# EAGLE design pcb_telemetria (EAGLE 9.5.1)
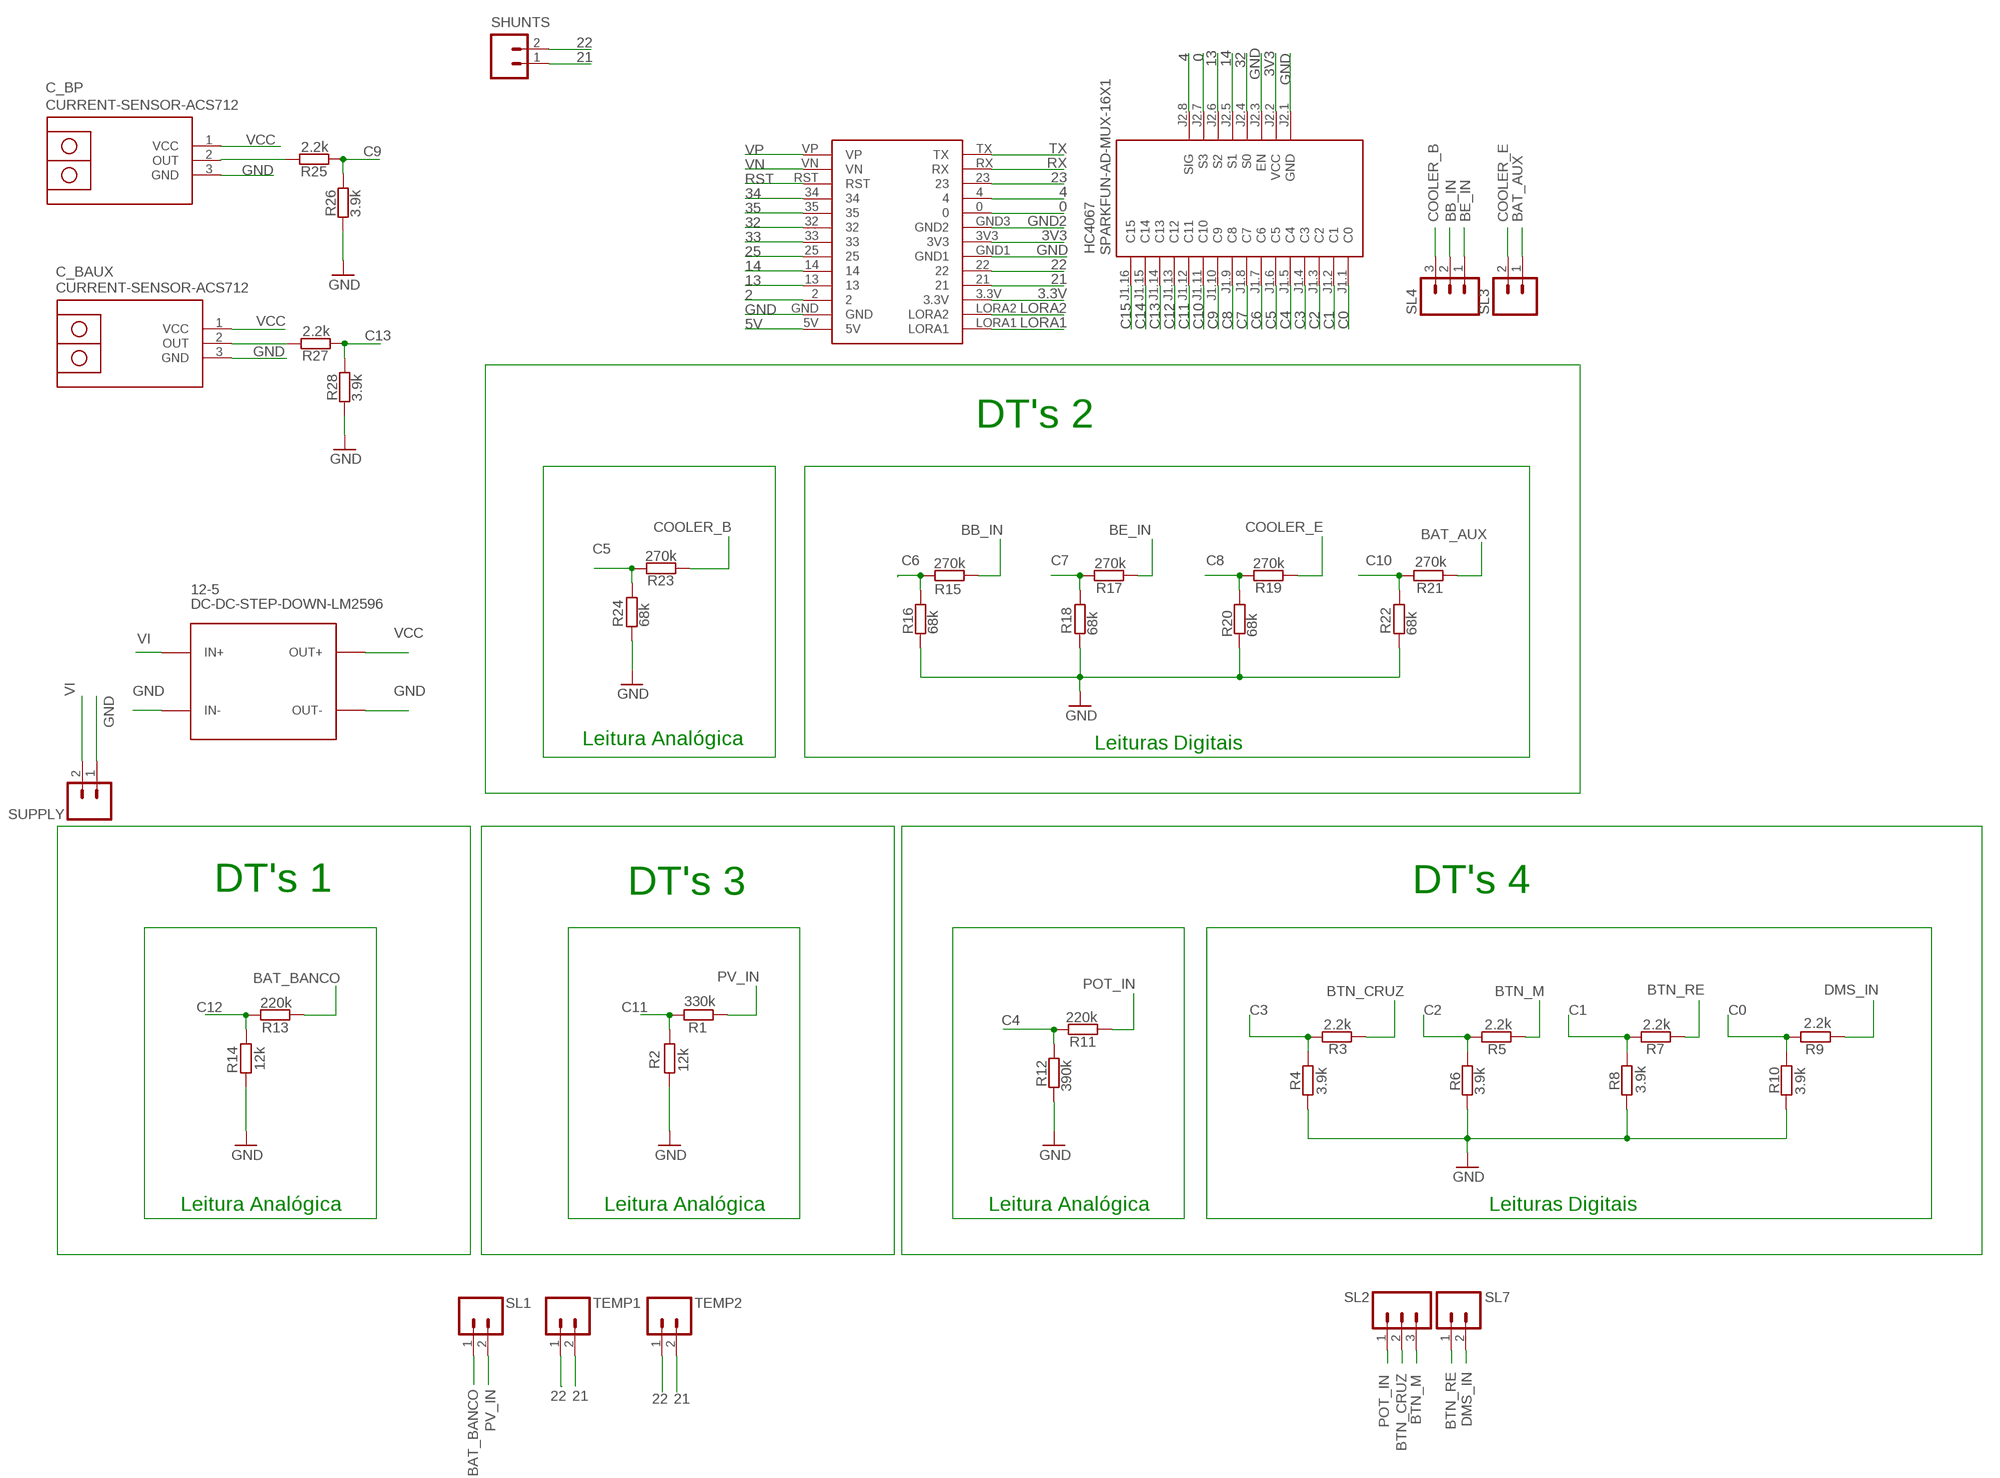
[diagram p0: schematic, sheet 1]

## Parts
12-5  DC-DC-STEP-DOWN-LM2596  [DC-DC-STEP-DOWN-LM2596]
C_BAUX  CURRENT-SENSOR-ACS712  [CURRENT-SENSOR-ACS712]
C_BP  CURRENT-SENSOR-ACS712  [CURRENT-SENSOR-ACS712]
HC4067  SPARKFUN-AD-MUX-16X1  [SPARKFUN-AD-MUX-16X1]
R1  330k  R-EU_0204/7  [0204/7]
R2  12k  R-EU_0204/7  [0204/7]
R3  2.2k  R-EU_0204/7  [0204/7]
R4  3.9k  R-EU_0204/7  [0204/7]
R5  2.2k  R-EU_0204/7  [0204/7]
R6  3.9k  R-EU_0204/7  [0204/7]
R7  2.2k  R-EU_0204/7  [0204/7]
R8  3.9k  R-EU_0204/7  [0204/7]
R9  2.2k  R-EU_0204/7  [0204/7]
R10  3.9k  R-EU_0204/7  [0204/7]
R11  220k  R-EU_0204/7  [0204/7]
R12  390k  R-EU_0204/7  [0204/7]
R13  220k  R-EU_0204/7  [0204/7]
R14  12k  R-EU_0204/7  [0204/7]
R15  270k  R-EU_0204/7  [0204/7]
R16  68k  R-EU_0204/7  [0204/7]
R17  270k  R-EU_0204/7  [0204/7]
R18  68k  R-EU_0204/7  [0204/7]
R19  270k  R-EU_0204/7  [0204/7]
R20  68k  R-EU_0204/7  [0204/7]
R21  270k  R-EU_0204/7  [0204/7]
R22  68k  R-EU_0204/7  [0204/7]
R23  270k  R-EU_0204/7  [0204/7]
R24  68k  R-EU_0204/7  [0204/7]
R25  2.2k  R-EU_0204/7  [0204/7]
R26  3.9k  R-EU_0204/7  [0204/7]
R27  2.2k  R-EU_0204/7  [0204/7]
R28  3.9k  R-EU_0204/7  [0204/7]
SHUNTS  M02  [02P]
SL1  M02  [02P]
SL2  M03  [03P]
SL3  M02  [02P]
SL4  M03  [03P]
SL7  M02  [02P]
SUPPLY  M02  [02P]
TEMP1  M02  [02P]
TEMP2  M02  [02P]
U$1  TTGOBEAM  [TTGOBEAM]

## Nets
0: HC4067.J2.7(S3) U$1.0
2: U$1.2
3.3V: U$1.3.3V
3V3: HC4067.J2.2(VCC) U$1.3V3
4: HC4067.J2.8(SIG) U$1.4
5V: U$1.5V
13: HC4067.J2.6(S2) U$1.13
14: HC4067.J2.5(S1) U$1.14
21: SHUNTS.1 TEMP1.2 TEMP2.2 U$1.21
22: SHUNTS.2 TEMP1.1 TEMP2.1 U$1.22
23: U$1.23
25: U$1.25
32: HC4067.J2.4(S0) U$1.32
33: U$1.33
34: U$1.34
35: U$1.35
BAT_AUX: R21.2 SL3.1
BAT_BANCO: R13.2 SL1.1
BB_IN: R15.1 SL4.2
BE_IN: R17.2 SL4.1
BTN_CRUZ: R3.1 SL2.2
BTN_M: R5.2 SL2.3
BTN_RE: R7.1 SL7.1
C0: HC4067.J1.1(C0) R9.1 R10.2
C1: HC4067.J1.2(C1) R7.2 R8.1
C2: HC4067.J1.3(C2) R5.1 R6.2
C3: HC4067.J1.4(C3) R3.2 R4.1
C4: HC4067.J1.5(C4) R11.2 R12.1
C5: HC4067.J1.6(C5) R23.2 R24.1
C6: HC4067.J1.7(C6) R15.2 R16.1
C7: HC4067.J1.8(C7) R17.1 R18.2
C8: HC4067.J1.9(C8) R19.2 R20.1
C9: HC4067.J1.10(C9) R25.1 R26.1
C10: HC4067.J1.11(C10) R21.1 R22.2
C11: HC4067.J1.12(C11) R1.1 R2.2
C12: HC4067.J1.13(C12) R13.1 R14.2
C13: HC4067.J1.14(C13) R27.1 R28.1
C14: HC4067.J1.15(C14)
C15: HC4067.J1.16(C15)
COOLER_B: R23.1 SL4.3
COOLER_E: R19.1 SL3.2
DMS_IN: R9.2 SL7.2
GND: 12-5.IN- 12-5.OUT- C_BAUX.3(GND) C_BP.3(GND) HC4067.J2.1(GND) HC4067.J2.3(EN) R2.1 R4.2 R6.1 R8.2 R10.1 R12.2 R14.1 R16.2 R18.1 R20.2 R22.1 R24.2 R26.2 R28.2 SUPPLY.1 U$1.GND U$1.GND1
GND2: U$1.GND3(GND2)
LORA1: U$1.LORA1
LORA2: U$1.LORA2
N$1: C_BP.2(OUT) R25.2
N$2: C_BAUX.2(OUT) R27.2
POT_IN: R11.1 SL2.1
PV_IN: R1.2 SL1.2
RST: U$1.RST
RX: U$1.RX
TX: U$1.TX
VCC: 12-5.OUT+ C_BAUX.1(VCC) C_BP.1(VCC)
VI: 12-5.IN+ SUPPLY.2
VN: U$1.VN
VP: U$1.VP

## Notes on the sheet
- DT's 2
- Leitura Analógica | Leituras Digitais
- DT's 1 | DT's 3 | DT's 4
- Leitura Analógica | Leitura Analógica | Leitura Analógica | Leituras Digitais

## Library data of the parts
12-5 = diy-modules:DC-DC-STEP-DOWN-LM2596: DC/DC Step-Down Regulator based on LM2596-ADJ chip LM2596 datasheet available here: http://www.ti.com/lit/ds/symlink/lm2596.pdf Click here to find device on ebay.com <http://www.ebay.com/sch/lm2596+power+regulator>
C_BAUX C_BP = diy-modules:CURRENT-SENSOR-ACS712: Isolated Bipolar Current Sensors based on ACS712 chip More details available here: http://embedded-lab.com/blog/a-brief-overview-of-allegro-acs712-current-sensor-part-1/ Click here to find device on ebay.com <http://www.ebay.com/sch/acs712+module> Note: There are many available versions with different pinout. Please check before use
HC4067 = diy-modules:SPARKFUN-AD-MUX-16X1: SparkFun Analog/Digital MUX Breakout based on CD74HC4067 chip Source: https://www.sparkfun.com/products/9056
R1-R28 = rcl:R-EU_: RESISTOR, European symbol; SPICEPREFIX: R
SHUNTS SL1 SL3 SL7 SUPPLY TEMP1 TEMP2 = con-amp-quick:M02: AMP QUICK CONNECTOR; OC_FARNELL: unknown; OC_NEWARK: unknown
SL2 SL4 = con-amp-quick:M03: AMP QUICK CONNECTOR; OC_FARNELL: unknown; OC_NEWARK: unknown
U$1 = bibliotecattgo:TTGOBEAM

## Board
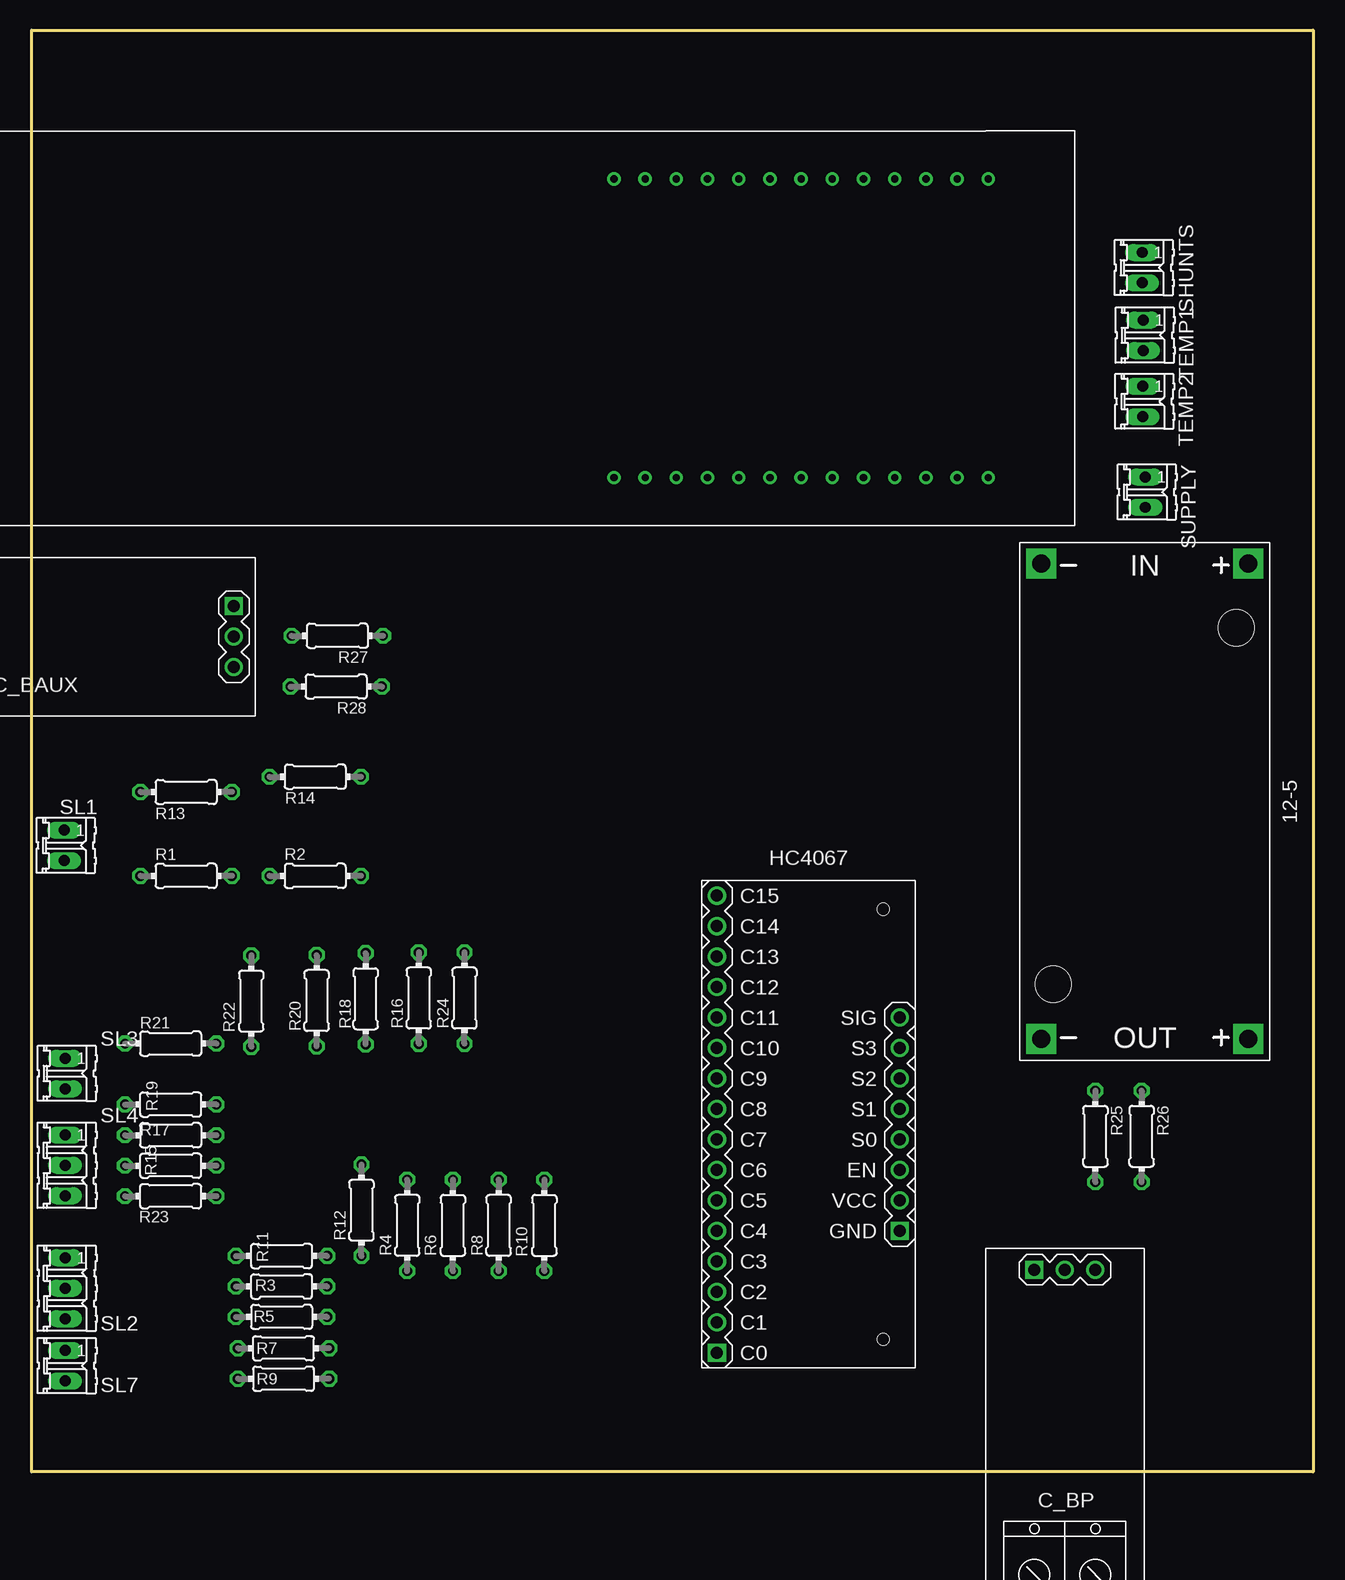
[diagram p1: board, top side]
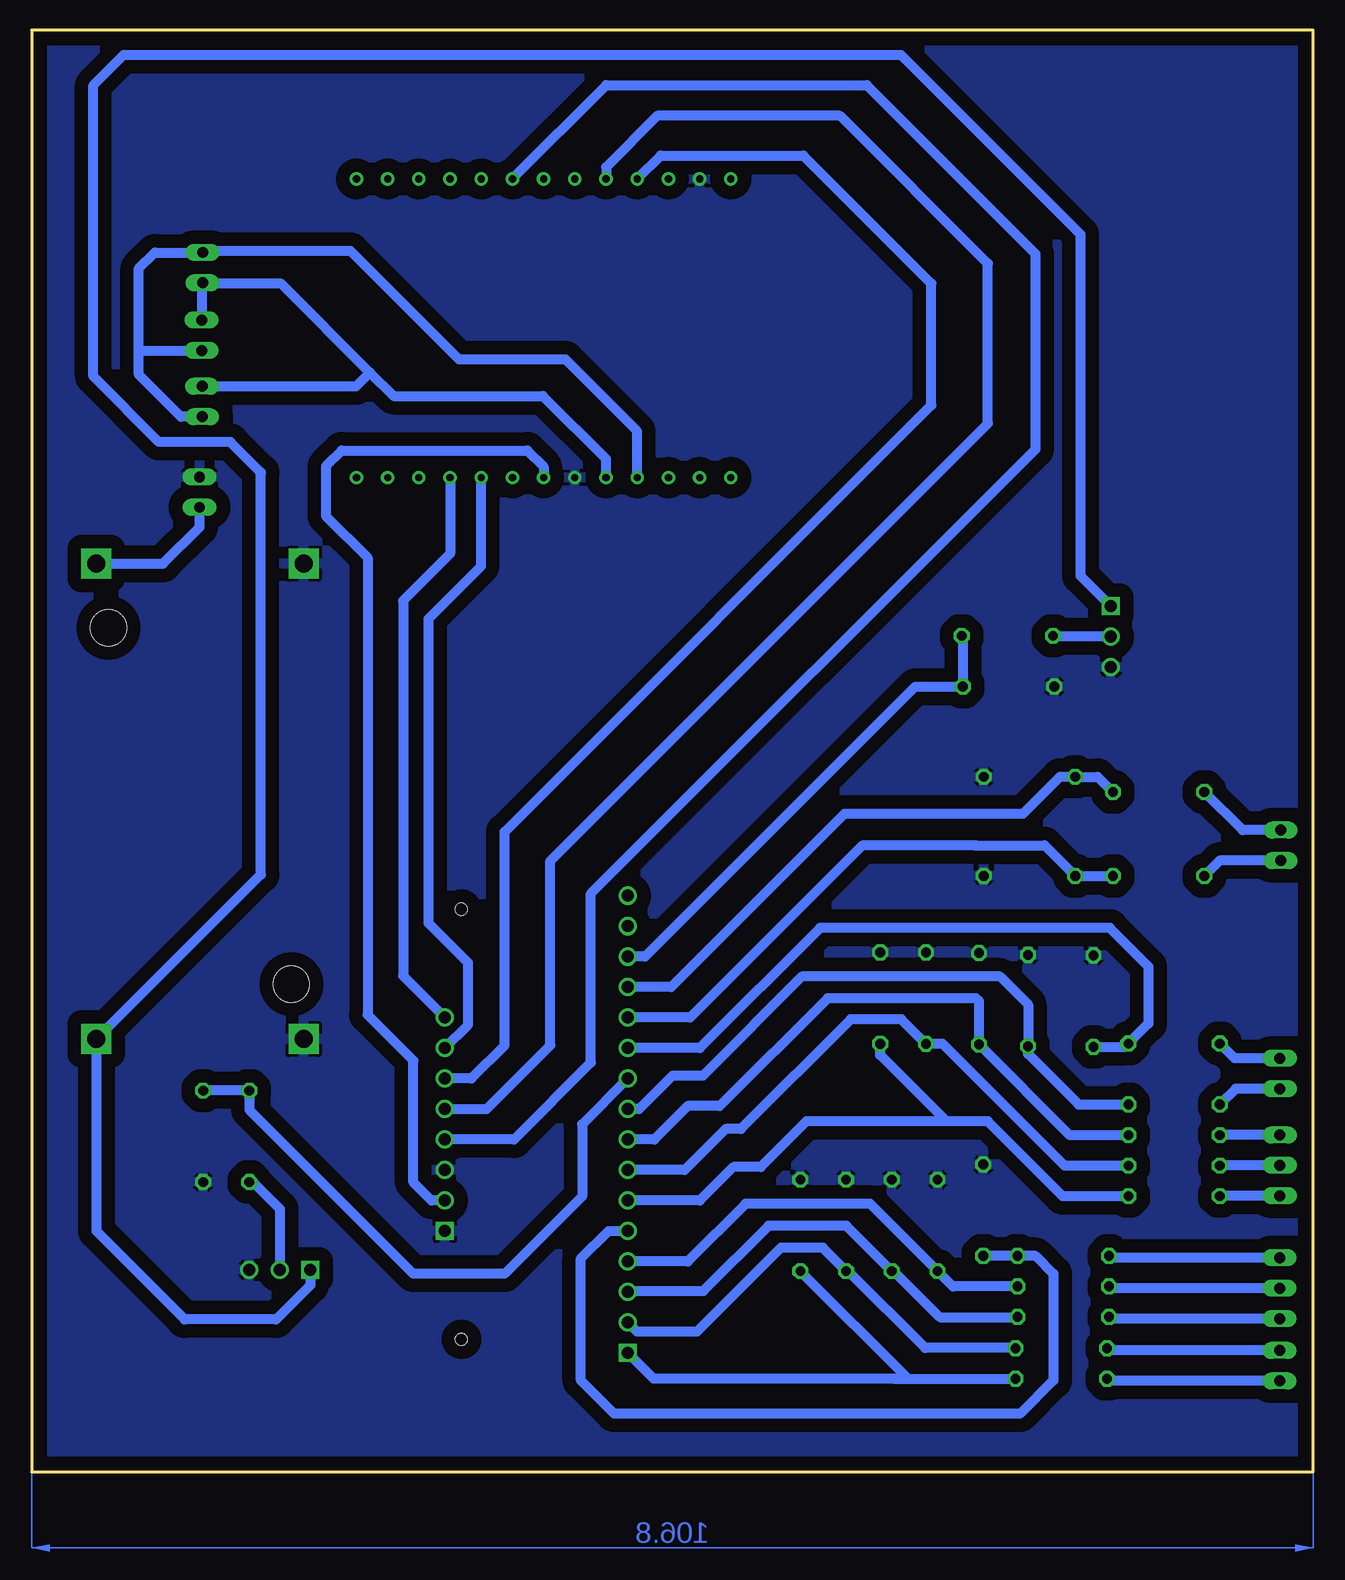
[diagram p2: board, bottom side, seen from below]

Size 106.8 x 120.19 mm. Coordinates in mm from the lower left corner, seen from the top.
Outline: 0,0 0,120.19 106.8,120.19 106.8,0 0,0
Copper layers (1*16): Top 0.035mm / dielectric 1.5mm / Bottom 0.035mm
Design rules "default *": minimum track width 32mil, minimum drill 0.35mm, track to track 24mil, track to pad 24mil, pad to pad 24mil, via to via 24mil, smd to smd 24mil, copper to edge 40mil, drill to drill 24mil, minimum pad ring 10mil, minimum via ring 8mil, stop-mask expansion 4mil, vias tented up to drill 0mil, thermal gap 10mil

### Footprints (pad centres in the part's own frame; a part is rotated, then mirrored left to right if it is on the bottom)
DC-DC-STEP-DOWN-LM2596 = drill 1.5 pad 2.5 square: IN+ -19.812,8.636; IN- -19.812,-8.636; OUT+ 19.812,8.636; OUT- 19.812,-8.636 | hole 3: -14.478,7.62; 15.24,-7.62
CURRENT-SENSOR-ACS712 = drill 1 square: 1 13.97,2.54 | drill 1: 2 13.97,0; 3 13.97,-2.54
SPARKFUN-AD-MUX-16X1 = drill 1 square: J1.1 -7.62,-19.05; J2.1 7.62,-8.89 | drill 1: J1.2 -7.62,-16.51; J1.3 -7.62,-13.97; J1.4 -7.62,-11.43; J1.5 -7.62,-8.89; J1.6 -7.62,-6.35; J1.7 -7.62,-3.81; J1.8 -7.62,-1.27; J1.9 -7.62,1.27; J1.10 -7.62,3.81; J1.11 -7.62,6.35; J1.12 -7.62,8.89; J1.13 -7.62,11.43; J1.14 -7.62,13.97; J1.15 -7.62,16.51; J1.16 -7.62,19.05; J2.2 7.62,-6.35; J2.3 7.62,-3.81; J2.4 7.62,-1.27; J2.5 7.62,1.27; J2.6 7.62,3.81; J2.7 7.62,6.35; J2.8 7.62,8.89 | hole 1: 6.245,-17.93; 6.245,17.93
0204/7 = drill 0.813 octagon: 1 -3.81,0; 2 3.81,0
02P = drill 0.914 long: 1 -1.27,0; 2 1.27,0
03P = drill 0.914 long: 1 -2.54,0; 2 0,0; 3 2.54,0
TTGOBEAM = drill 0.6: 0 11.9,5.8; 2 -13,-9.8; 3.3V 11.9,-9.8; 3V3 11.9,0.6; 4 11.9,8.4; 5V -13,-15; 13 -13,-7.2; 14 -13,-4.6; 21 11.9,-7.2; 22 11.9,-4.6; 23 11.9,11; 25 -13,-2; 32 -13,3.2; 33 -13,0.6; 34 -13,8.4; 35 -13,5.8; GND -13,-12.4; GND1 11.9,-2; GND3 11.9,3.2; LORA1 11.9,-15; LORA2 11.9,-12.4; RST -13,11; RX 11.9,13.6; TX 11.9,16.2; VN -13,13.6; VP -13,16.2

### Placement (x,y rotation side)
12-5  92.77,55.88 270 top
C_BAUX  2.89,69.62 0 top
C_BP  86.11,2.87 90 top
HC4067  64.74,28.97 0 top
R1  12.88,49.67 180 top
R2  23.64,49.67 180 top
R3  20.83,15.45 0 top
R4  31.3,20.54 90 top
R5  20.83,12.91 180 top
R6  35.11,20.54 270 top
R7  21,10.29 0 top
R8  38.92,20.54 90 top
R9  21,7.75 180 top
R10  42.73,20.54 270 top
R11  20.83,17.99 0 top
R12  27.49,21.81 90 top
R13  12.88,56.67 180 top
R14  23.64,57.94 180 top
R15  11.59,25.52 0 top
R16  32.27,39.49 90 top
R17  11.59,28.06 180 top
R18  27.84,39.44 270 top
R19  11.59,30.62 0 top
R20  23.76,39.27 90 top
R21  11.59,35.7 180 top
R22  18.31,39.23 270 top
R23  11.59,22.98 0 top
R24  36.08,39.49 90 top
R25  88.65,27.97 270 top
R26  92.5,27.97 270 top
R27  25.48,69.69 180 top
R28  25.38,65.46 180 top
SHUNTS  92.54,100.38 270 top
SL1  2.72,52.21 270 top
SL2  2.8,15.3 270 top
SL3  2.79,33.21 270 top
SL4  2.79,25.54 270 top
SL7  2.8,8.84 270 top
SUPPLY  92.81,81.67 270 top
TEMP1  92.63,94.74 270 top
TEMP2  92.6,89.23 270 top
U$1  63.53,94.78 270 top

### Tracks (layer width: path | path; a pad name or v marks a point on that pad's centre or on a via)
0
  Bottom 0.813: HC4067.J2.7 70.42,37.26 70.42,42.42 73.72,45.72 73.72,71.12 69.33,75.51 U$1.0
3V3
  Bottom 0.813: U$1.3V3 64.13,83.78 65.49,85.14 80.97,85.14 82.28,83.83 82.28,79.68 78.8,76.2 78.8,38.1 74.99,34.29 74.99,24.13 73.48,22.62 HC4067.J2.2
4
  Bottom 0.813: U$1.4 71.93,76.53 75.84,72.62 75.84,41.34 HC4067.J2.8
13
  Bottom 0.813: HC4067.J2.6 70.15,32.78 67.37,35.56 67.37,53.34 31.81,88.9 31.81,99.06 42.48,109.73 54.38,109.73 U$1.13
14
  Bottom 0.813: HC4067.J2.5 68.88,30.24 63.56,35.56 63.56,50.93 27.11,87.38 27.11,100.71 39.43,113.03 54.67,113.03 58.93,108.77 U$1.14
21
  Bottom 0.813: U$1.21 56.33,86.75 62.29,92.71 71.18,92.71 80.24,101.77 92.41,101.77 SHUNTS.1 96.53,101.65 97.85,100.33 97.85,93.47 | 97.85,93.47 97.85,91.44 94.37,87.95 TEMP2.2 | 97.85,93.47 TEMP1.2
22
  Bottom 0.813: U$1.22 58.93,84.42 64.18,89.68 76.64,89.68 78.6,91.64 | 78.6,91.64 85.98,99.02 92.63,99.02 | SHUNTS.2 92.63,99.02 | 92.63,99.02 TEMP1.1 | TEMP2.1 79.75,90.5 78.6,91.64
32
  Bottom 0.813: U$1.32 58.92,115.59 37.2,115.59 23.12,101.5 23.12,85.25 60.18,48.19 60.18,34.11 66.59,27.7 HC4067.J2.4
BAT_AUX
  Bottom 0.813: SL3.1 6.56,34.48 R21.2
BAT_BANCO
  Bottom 0.813: SL1.1 5.88,53.48 R13.2
BB_IN
  Bottom 0.813: SL4.2 7.75,25.54 R15.1
BE_IN
  Bottom 0.813: SL4.1 7.75,28.08 R17.2
BTN_CRUZ
  Bottom 0.813: SL2.2 16.86,15.3 R3.1
BTN_M
  Bottom 0.813: SL2.3 16.86,12.76 R5.2
BTN_RE
  Bottom 0.813: SL7.1 17,10.11 R7.1
C0
  Bottom 0.813: 34.97,7.75 34.97,7.76 24.81,7.76 R9.1 | 34.97,7.75 35.03,7.75 54.95,7.75 HC4067.J1.1 | R10.2 33.76,7.75 34.97,7.75
C1
  Bottom 0.813: HC4067.J1.2 56.36,11.7 51.33,11.7 44.36,18.67 40.86,18.67 R8.1 38.75,16.73 32.35,10.32 24.83,10.32 R7.2
C2
  Bottom 0.813: HC4067.J1.3 57.05,15.07 50.81,15.07 45.37,20.51 38.89,20.51 R6.2 34.94,16.73 31.1,12.89 24.67,12.89 R5.1
C3
  Bottom 0.813: HC4067.J1.4 52.12,17.54 47.3,22.35 36.93,22.35 R4.1 30.03,15.45 R3.2
C4
  Bottom 0.813: R12.1 R11.2 23.14,18 21.65,16.51 21.65,7.62 24.42,4.85 58.25,4.85 61.02,7.62 61.02,17.78 58.72,20.08 HC4067.J1.5
C5
  Bottom 0.813: R23.2 20.88,22.98 27.11,29.21 30.54,29.21 | 30.54,29.21 36.08,34.75 R24.1 | HC4067.J1.6 51.1,22.62 48.32,25.4 46.03,25.4 42.22,29.21 30.54,29.21
C6
  Bottom 0.813: R15.2 20.71,25.52 30.87,35.68 R16.1 34.31,37.72 38.54,37.72 47.69,28.57 48.96,28.57 52.37,25.16 HC4067.J1.7
C7
  Bottom 0.813: R17.1 20.27,28.06 R18.2 27.84,39.21 28.1,39.47 40.47,39.47 49.46,30.48 52.13,30.48 54.91,27.7 HC4067.J1.8
C8
  Bottom 0.813: R19.2 19.55,30.62 23.76,34.83 R20.1 23.76,38.94 26.1,41.28 42.61,41.28 50.86,33.02 53.4,33.02 56.18,30.24 HC4067.J1.9
C9
  Bottom 0.813: R26.1 R25.1 88.65,30.17 74.99,16.51 67.37,16.51 60.93,22.95 60.93,28.97 HC4067.J1.10
C10
  Bottom 0.813: R22.2 15.67,35.42 R21.1 13.74,37.36 13.74,42.12 16.95,45.34 41.08,45.34 51.1,35.32 HC4067.J1.11
C11
  Bottom 0.813: R1.1 R2.2 22.37,52.21 28.11,52.21 28.13,52.2 37.59,52.2 51.92,37.86 HC4067.J1.12
C12
  Bottom 0.813: R13.1 17.96,57.94 R14.2 21.1,57.94 24.18,54.86 39.05,54.86 53.51,40.4 HC4067.J1.13
C13
  Bottom 0.813: R27.1 29.19,69.59 R28.1 33.15,65.46 55.67,42.94 HC4067.J1.14
COOLER_B
  Bottom 0.813: SL4.3 7.75,23 R23.1
COOLER_E
  Bottom 0.813: SL3.2 6.46,31.93 R19.1
DMS_IN
  Bottom 0.813: SL7.2 17,7.57 R9.2
GND
  pour Bottom (isolate 1.143): -3.75,123.19 -3.75,-1.27 1.33,-6.35 113.09,-6.35 119.44,0 119.44,109.22 105.47,123.19
N$1
  Bottom 0.813: R25.2 88.35,24.15 86.11,21.91 C_BP.2
N$2
  Bottom 0.813: C_BAUX.2 21.6,69.62 R27.2
POT_IN
  Bottom 0.813: SL2.1 16.86,17.84 R11.1
PV_IN
  Bottom 0.813: SL1.2 7.8,50.94 R1.2
VCC
  Bottom 0.813: C_BP.1 83.57,15.55 86.42,12.7 94.04,12.7 101.41,20.07 12-5.OUT+ 87.69,49.78 87.69,83.31 90.23,85.85 96.2,85.85 101.66,91.31 101.66,115.57 99.12,118.11 34.35,118.11 19.39,103.15 19.39,74.7 C_BAUX.1
VI
  Bottom 0.813: 12-5.IN+ 95.86,75.69 92.81,78.75 SUPPLY.2
(copper drawn outside any net)
  shapes: Bottom area x1